# Altium schematic sheet Power_Supplies.SchDoc
size A
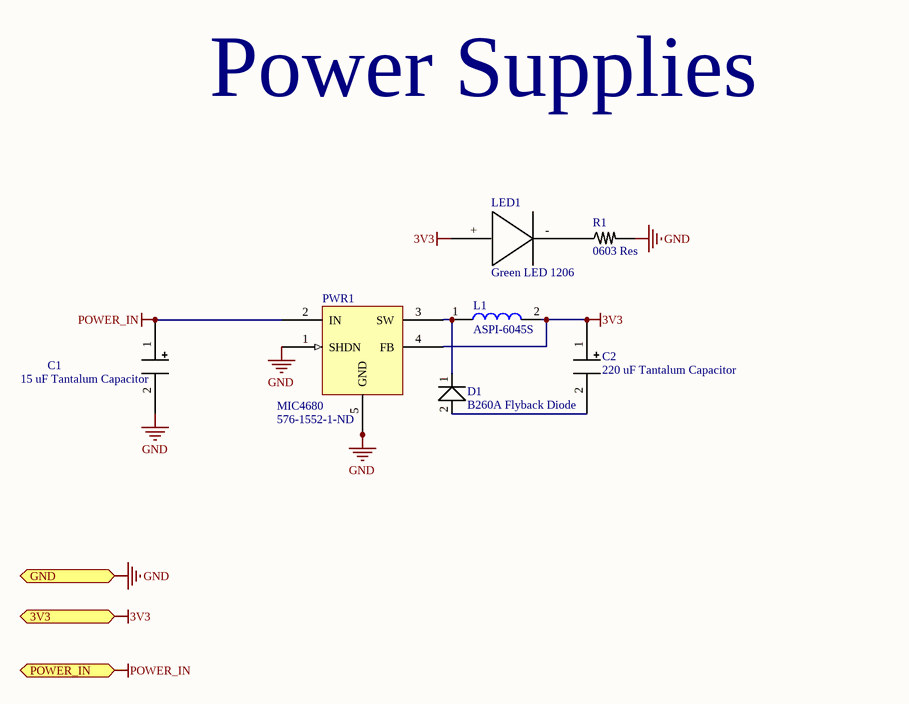
[diagram p0: Power_Supplies.SchDoc]

## Parts
C1  15 uF Tantalum Capacitor  [1206 (POLAR)]
C2  220 uF Tantalum Capacitor  [1206 (POLAR)]
D1  B260A Flyback Diode  [DO-214AC]
L1  ASPI-6045S  [ASPI-6045]
LED1  Green LED 1206  [Cathode Mark 1206 led footprint]
PWR1  MIC4680  Supplier Part Number 1: 576-1552-1-ND  [TJA1040]
R1  0603 Res  [0603/1608 SMD Resistor]

## Ports
3V3, GND, POWER_IN

## Nets
3V3: C2.1 L1.2 LED1.+ PWR1.4(FB) ; port 3V3
GND: C1.2 PWR1.1(SHDN) PWR1.5(GND) PWR1.6 PWR1.7 PWR1.8 R1.2 ; port GND
POWER_IN: C1.1 PWR1.2(IN) ; port POWER_IN
NetC2_2: C2.2 D1.2
NetD1_1: D1.1 L1.1 PWR1.3(SW)
NetLED1_-: LED1.- R1.1

## Notes on the sheet
- Power Supplies

## Library data of the parts
C1 C2 = 15 uF Tantalum Capacitor: 1206 Surface Mount Capacitor
L1 = ASPI-6045S: 68 uH 1.2A surface mount inductor
LED1 = 1206 Green LED: Green surface mount LED
PWR1 = MIC4680: 3.3V Fixed Switching Regulator 1A; Supplier 1: Digi-Key